# EAGLE design zigduino-v6 (EAGLE 5.10)
BOM: INCLUDE; COLOR: RED; DNP: T; PARTNO: C1608C0G1H090C; VOLT: 40V
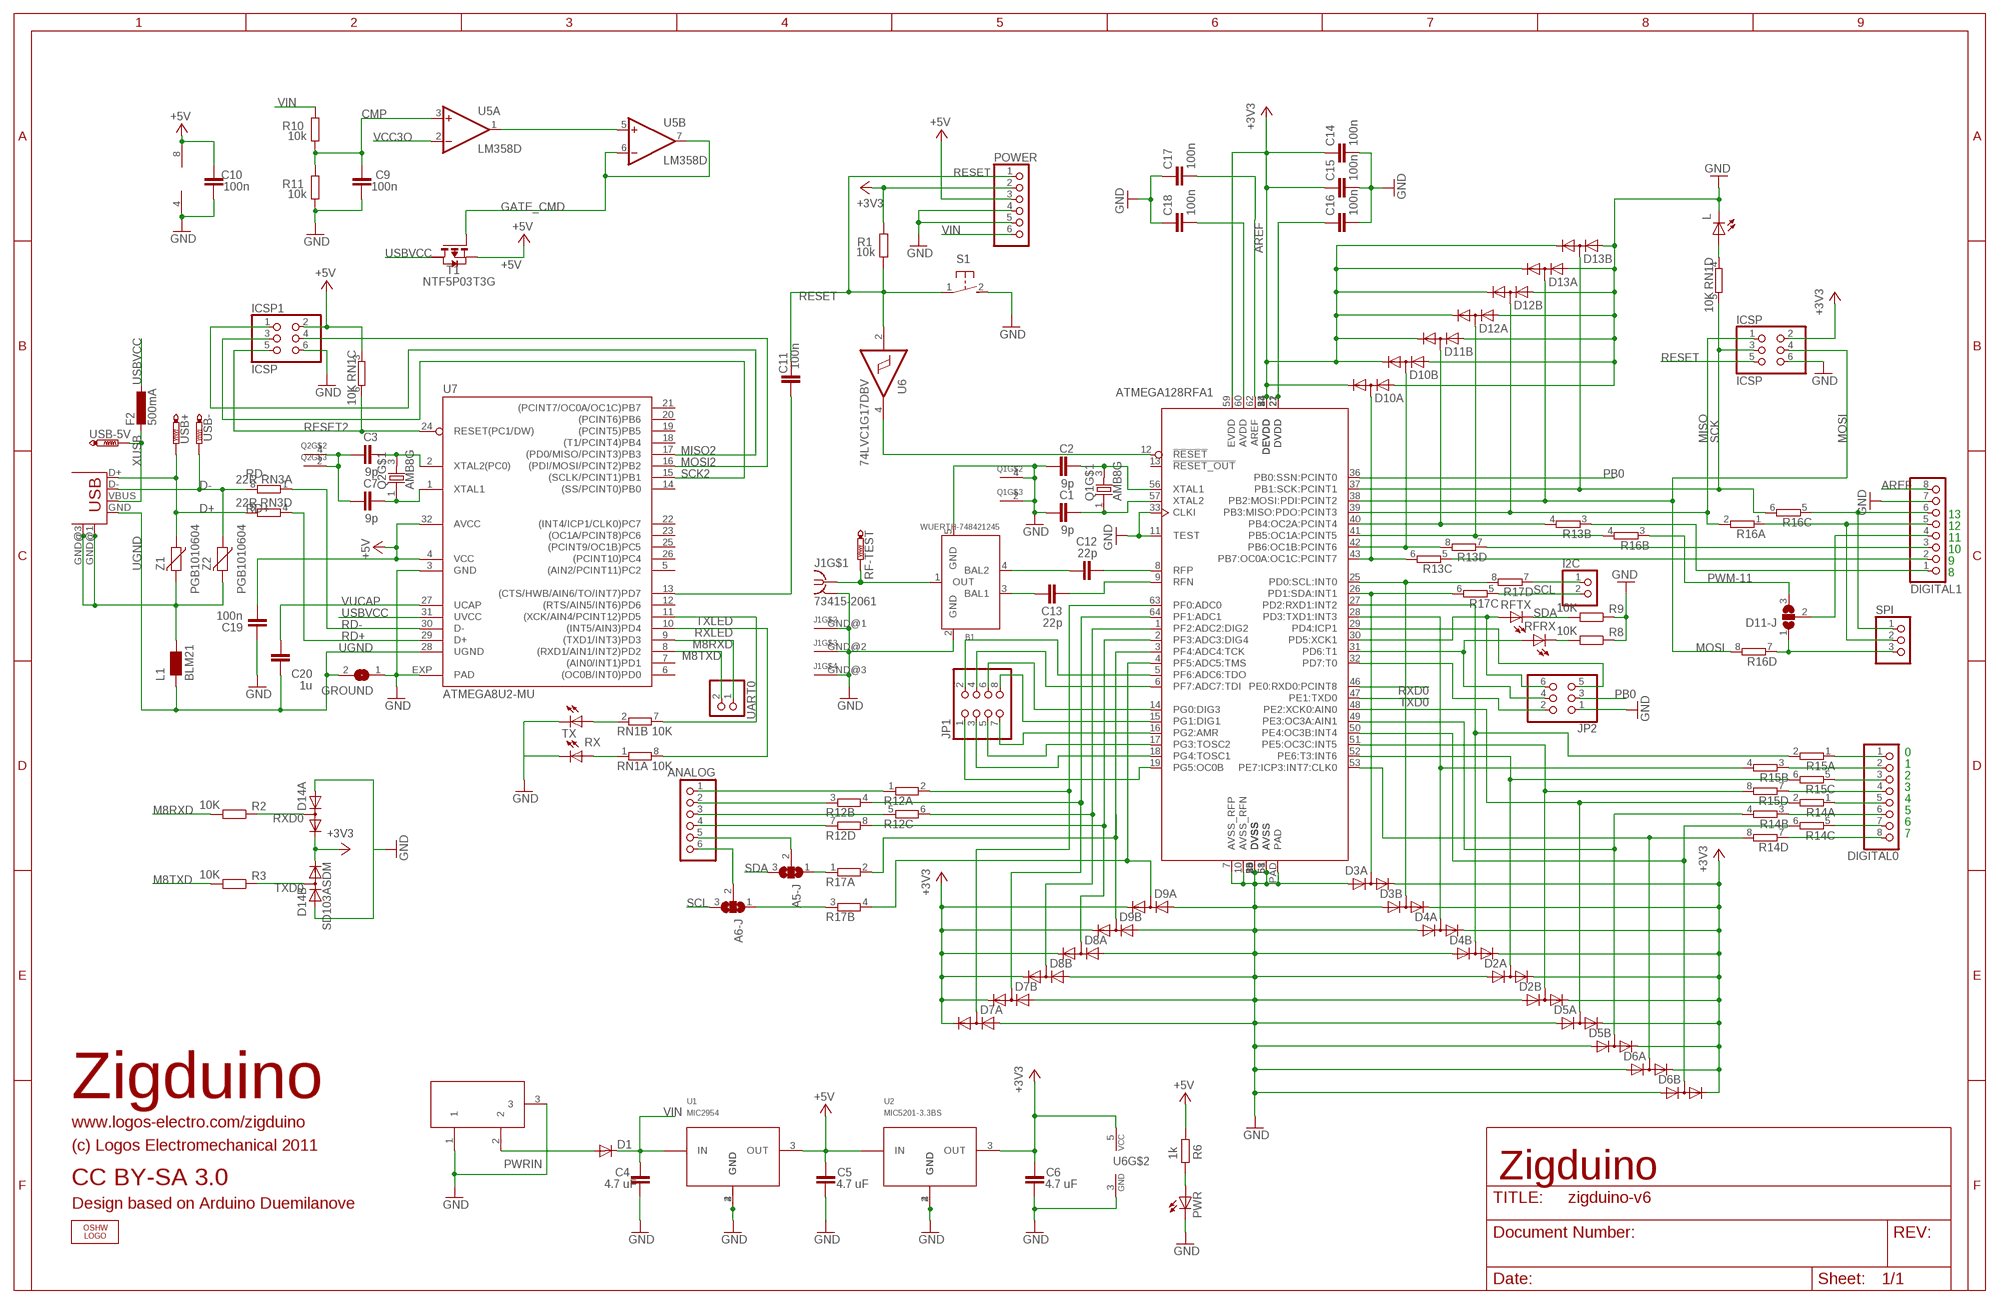
[diagram p0: schematic, sheet 1]

## Parts
A5-J  SJ2W  [SJ_2]
A6-J  SJ2W  [SJ_2]
ANALOG  PINHD-1X6  [1X06]
B1  WUERTH-748421245  [WURTH-BALUN]
C1  9p  C-EUC0603  [C0603]
C2  9p  C-EUC0603  [C0603]
C3  9p  C-EUC0603  [C0603]
C4  4.7 uF  C-EUC1206  [C1206]
C5  4.7 uF  C-EUC1206  [C1206]
C6  4.7 uF  C-EUC1206  [C1206]
C7  9p  C-EUC0603  [C0603]
C9  100n  C-EUC0603  [C0603]
C10  100n  C-EUC0603  [C0603]
C11  100n  C-EUC0603  [C0603]
C12  22p  C-EUC0603  [C0603]
C13  22p  C-EUC0603  [C0603]
C14  100n  C-EUC0603  [C0603]
C15  100n  C-EUC0603  [C0603]
C16  100n  C-EUC0603  [C0603]
C17  100n  C-EUC0603  [C0603]
C18  100n  C-EUC0603  [C0603]
C19  100n  C-EU0603-RND  [C0603-ROUND]
C20  1u  C-EU0603-RND  [C0603-ROUND]
D1  DIODE-SMB  [SMB]
D2  SD103ASDM  [SOT26]
D3  SD103ASDM  [SOT26]
D4  SD103ASDM  [SOT26]
D5  SD103ASDM  [SOT26]
D6  SD103ASDM  [SOT26]
D7  SD103ASDM  [SOT26]
D8  SD103ASDM  [SOT26]
D9  SD103ASDM  [SOT26]
D10  SD103ASDM  [SOT26]
D11  SD103ASDM  [SOT26]
D11-J  SJ2W  [SJ_2]
D12  SD103ASDM  [SOT26]
D13  SD103ASDM  [SOT26]
D14  SD103ASDM  [SOT26]
DC-PWR  DC21MMX  [DC-21MM]
DIGITAL0  PINHD-1X8  [1X08]
DIGITAL1  PINHD-1X8  [1X08]
F2  500mA  L-EUL1812  [L1812]
GROUND  SJ  [SJ]
I2C  PINHD-1X2  [1X02]
ICSP  ICSP  PINHD-2X3  [2X03]
ICSP1  ICSP  PINHD-2X3  [2X03]
J1  73415-2061  [MMCX]
JP1  PINHD-2X4_2.00  [2X04M]
JP2  PINHD-2X3_2.00  [2X03M]
L  LEDCHIP-LED0603  [CHIP-LED0603]
L1  BLM21  WE-CBF_0805  [0805]
LOGO1  OSHW_LOGO_FILLX0200-NT  [OSHW_FILLX200_NOTEXT]
POWER  PINHD-1X6  [1X06]
PWR  LEDCHIP-LED0603  [CHIP-LED0603]
Q1  AMB8G  [ABM8G]
Q2  AMB8G  [ABM8G]
R1  10k  R-EU_R0603  [R0603]
R2  10K  R-EU_R0603  [R0603]
R3  10K  R-EU_R0603  [R0603]
R6  1k  R-EU_R0603  [R0603]
R8  10K  R-EU_R0603  [R0603]
R9  10K  R-EU_R0603  [R0603]
R10  10k  R-EU_R0603  [R0603]
R11  10k  R-EU_R0603  [R0603]
R12  4R-NCTS742C083  [CTS742C083-RES]
R13  4R-NCTS742C083  [CTS742C083-RES]
R14  4R-NCTS742C083  [CTS742C083-RES]
R15  4R-NCTS742C083  [CTS742C083-RES]
R16  4R-NCTS742C083  [CTS742C083-RES]
R17  4R-NCTS742C083  [CTS742C083-RES]
RF-TEST  PTR1TP13SQ  [TP13SQ]
RFRX  LEDCHIP-LED0603  [CHIP-LED0603]
RFTX  LEDCHIP-LED0603  [CHIP-LED0603]
RN1  10K  4R-NCAY16  [CAY16]
RN3  22R  4R-NCAY16  [CAY16]
RX  LEDCHIP-LED0603  [CHIP-LED0603]
S1  B3U-1000  [B3U]
SPI  PINHD-1X3  [1X03]
T1  NTF5P03T3G  PMOSSOT223  [SOT223]
TX  LEDCHIP-LED0603  [CHIP-LED0603]
U1  MIC2954  [SOT223]
U2  MIC5201-3.3BS  [SOT223]
U3  ATMEGA128RFA1  [QFN64]
U5  LM358D  [SO08]
U6  74LVC1G17DBV  [SOT23-5]
U7  ATMEGA8U2-MU  [QFN32]
UART0  PINHD-1X2  [1X02]
USB  USB-MB-S  [USB-MB-S]
USB+  PTR1TP13SQ  [TP13SQ]
USB-  PTR1TP13SQ  [TP13SQ]
USB-5V  PTR1TP13SQ  [TP13SQ]
Z1  PGB1010604  VARISTORCN0603  [CT/CN0603]
Z2  PGB1010604  VARISTORCN0603  [CT/CN0603]

## Nets
+3V3: C6.1 C14.1 C15.1 D2.2(A:C) D2.5(B:C) D3.2(A:C) D3.5(B:C) D4.2(A:C) D4.5(B:C) D5.2(A:C) D5.5(B:C) D6.2(A:C) D6.5(B:C) D7.2(A:C) D7.5(B:C) D8.2(A:C) D8.5(B:C) D9.2(A:C) D9.5(B:C) D10.2(A:C) D10.5(B:C) D11.5(B:C) D12.2(A:C) D12.5(B:C) D13.2(A:C) D13.5(B:C) D14.2(A:C) D14.5(B:C) ICSP.2 POWER.2 R1.2 U2.3(OUT) U3.23(DEVDD) U3.34(DEVDD) U3.44(DEVDD) U3.54(DEVDD) U3.59(EVDD) U6.5(VCC)
+5V [usbvcc]: C5.1 C10.2 C19.1 ICSP1.2 POWER.3 R6.1 RN1.3 T1.3(S) U1.3(OUT) U2.1(IN) U5.8(P:V+) U7.4(VCC) U7.32(AVCC)
AREF [aref]: C17.2 DIGITAL1.8 U3.62(AREF)
CMP: C9.2 R10.1 R11.2 U5.3(A:+IN)
D+: RN3.5 USB+.TP USB.D+ Z1.1
D-: RN3.8 USB-.TP USB.D- Z2.1
DTR: C11.1 U7.13((CTS/HWB/AIN6/TO/INT7)PD7)
GATE_CMD: T1.1(G) U5.6(B:-IN) U5.7(B:OUT)
GND [gnd]: B1.2(GND) B1.5(GND) C1.1 C2.1 C4.2 C5.2 C6.2 C9.1 C10.1 C14.2 C15.2 C16.2 C17.1 C18.1 C19.2 D2.3(A:A) D2.6(B:A) D3.3(A:A) D3.6(B:A) D4.3(A:A) D4.6(B:A) D5.3(A:A) D5.6(B:A) D6.3(A:A) D6.6(B:A) D7.3(A:A) D7.6(B:A) D8.3(A:A) D8.6(B:A) D9.3(A:A) D9.6(B:A) D10.3(A:A) D10.6(B:A) D11.6(B:A) D12.3(A:A) D12.6(B:A) D13.3(A:A) D13.6(B:A) D14.3(A:A) D14.6(B:A) DC-PWR.1 DC-PWR.3 DIGITAL1.7 GROUND.1 ICSP1.6 ICSP.6 J1.GND@0(GND) J1.GND@1(PIN) J1.GND@2(PIN) J1.GND@3(PIN) JP2.1 L.C POWER.4 POWER.5 PWR.C Q1.2(PIN) Q1.4(PIN) R8.1 R9.1 R11.1 RX.C S1.2 TX.C U1.2(GND) U1.4(GND) U2.2(GND) U2.4(GND) U3.7(AVSS_RFP) U3.10(AVSS_RFN) U3.11(TEST) U3.20(DVSS) U3.24(DVSS) U3.33(CLKI) U3.35(DVSS) U3.45(DVSS) U3.55(DVSS) U3.58(AVSS) U3.61(AVSS) U3.PAD U5.4(P:V-) U6.3(GND) U7.3(GND) U7.EXP(PAD)
M8RXD: R2.2 U7.9((TXD1/INT3)PD3) UART0.1
M8TXD: R3.2 U7.8((RXD1/AIN1/INT2)PD2) UART0.2
MISO: D12.1(B:AC) ICSP.1 R16.2 U3.39(PB3:MISO:PDO:PCINT3)
MISO2: ICSP1.1 U7.17((PD0/MISO/PCINT3)PB3)
MOSI: D13.4(A:AC) ICSP.4 R16.8 U3.38(PB2:MOSI:PDI:PCINT2)
MOSI2: ICSP1.4 U7.16((PDI/MOSI/PCINT2)PB2)
MOSI-PIN: D11-J.1 R16.7 SPI.3
N$1: R9.2 RFTX.C
N$2: L.A RN1.4
N$3: PWR.A R6.2
N$4 [rf]: B1.4(BAL2) C12.1
N$5: DIGITAL0.3 R15.5
N$6: C1.2 Q1.1 U3.57(XTAL2)
N$7: C2.2 Q1.3 U3.56(XTAL1)
N$9 [rf]: B1.3(BAL1) C13.1
N$10: DIGITAL1.5 R16.1 SPI.2
N$11: DIGITAL0.5 R14.1
N$12: DIGITAL0.7 R14.5
N$13: DIGITAL0.6 R14.3
N$14: DIGITAL0.4 R15.7
N$15: DIGITAL0.8 R14.7
N$16: D3.1(B:AC) R17.8 U3.25(PD0:SCL:INT0)
N$17: D3.4(A:AC) R17.6 U3.26(PD1:SDA:INT1)
N$18 [gnd]: B1.1(OUT) J1.C RF-TEST.TP
N$19: D12.4(A:AC) R16.4 U3.41(PB5:OC1A:PCINT5)
N$20: R8.2 RFRX.C
N$21: D2.4(A:AC) R15.6 U3.52(PE6:T3:INT6)
N$22: D2.1(B:AC) R15.8 U3.51(PE5:OC3C:INT5)
N$23 [rf]: C12.2 U3.8(RFP)
N$24 [rf]: C13.2 U3.9(RFN)
N$25: DIGITAL1.6 R16.5 SPI.1
N$26: JP2.4 RFRX.A U3.31(PD6:T1)
N$27: JP2.6 RFTX.A U3.30(PD5:XCK1)
N$28: U5.1(A:OUT) U5.5(B:+IN)
N$29: U3.12(!RESET!) U6.4(O)
N$31: RN1.2 TX.A
N$32: RN1.1 RX.A
N$33: D11.1(B:AC) R13.4 U3.40(PB4:OC2A:PCINT4)
N$34: C3.2 Q2.3 U7.2(XTAL2(PC0))
N$35: C7.2 Q2.1 U7.1(XTAL1)
N$36: C3.1 C7.1 Q2.2(PIN) Q2.4(PIN)
N$38: D10.1(B:AC) R13.8 U3.42(PB6:OC1B:PCINT6)
N$39: D10.4(A:AC) R13.6 U3.43(PB7:OC0A:OC1C:PCINT7)
N$40: D5.4(A:AC) R14.2 U3.48(PE2:XCK0:AIN0)
N$41: D6.1(B:AC) R14.6 U3.50(PE4:OC3B:INT4)
N$42: D5.1(B:AC) R14.4 U3.49(PE3:OC3A:AIN1)
N$43: D6.4(A:AC) R14.8 U3.53(PE7:ICP3:INT7:CLK0)
N$44: A5-J.1 R17.1
N$45: A6-J.1 R17.3
N$46: JP1.2 U3.5(PF6:ADC6:TDO)
N$47: JP1.4 U3.6(PF7:ADC7:TDI)
N$48: D7.4(A:AC) R12.2 U3.63(PF0:ADC0)
N$49: D7.1(B:AC) R12.4 U3.64(PF1:ADC1)
N$50: D8.1(B:AC) R12.6 U3.1(PF2:ADC2:DIG2)
N$51: D8.4(A:AC) R12.8 U3.2(PF3:ADC3:DIG4)
N$52: D9.1(B:AC) R17.2 U3.3(PF4:ADC4:TCK)
N$53: D9.4(A:AC) R17.4 U3.4(PF5:ADC5:TMS)
N$54: ANALOG.1 R12.1
N$55: ANALOG.2 R12.3
N$56: ANALOG.3 R12.5
N$57: ANALOG.4 R12.7
N$58: A5-J.2 ANALOG.5
N$59: A6-J.2 ANALOG.6
N$60: DIGITAL1.1 R13.3
N$61: D11-J.2 DIGITAL1.4
N$62: JP1.6 U3.14(PG0:DIG3)
N$63: C16.1 U3.21(DVDD) U3.22(DVDD)
N$64: C18.2 U3.60(AVDD)
N$65: DIGITAL1.2 R13.5
N$68: DIGITAL0.1 R15.1
N$69: DIGITAL0.2 R15.3
N$70: JP1.8 U3.15(PG1:DIG1)
N$71: JP1.1 U3.19(PG5:OC0B)
N$72: JP1.3 U3.18(PG4:TOSC1)
N$73: JP1.5 U3.17(PG3:TOSC2)
N$74: JP1.7 U3.16(PG2:AMR)
N$75: JP2.2 U3.32(PD7:T0)
N$76: JP2.5 U3.29(PD4:ICP1)
PB0: JP2.3 U3.36(PB0:SSN:PCINT0)
PWM-10: DIGITAL1.3 R13.7
PWM-11: D11-J.3 R16.3
PWRIN [power]: D1.A DC-PWR.2
RD+: RN3.4 U7.29(D+)
RD-: RN3.1 U7.30(D-)
RESET: C11.2 ICSP.5 POWER.1 R1.1 S1.1 U6.2(I)
RESET2: ICSP1.5 RN1.6 U7.24(RESET(PC1/DW))
RXD0: D14.4(A:AC) R2.1 U3.46(PE0:RXD0:PCINT8)
RXD1: D4.1(B:AC) R15.2 U3.27(PD2:RXD1:INT2)
RXLED: RN1.8 U7.10((INT5/AIN3)PD4)
SCK: D13.1(B:AC) ICSP.3 R16.6 RN1.5 U3.37(PB1:SCK:PCINT1)
SCK2: ICSP1.3 U7.15((SCLK/PCINT1)PB1)
SCL: A6-J.3 I2C.1 R17.7
SDA: A5-J.3 I2C.2 R17.5
TXD0: D14.1(B:AC) R3.1 U3.47(PE1:TXD0)
TXD1: D4.4(A:AC) R15.4 U3.28(PD3:TXD1:INT3)
TXLED: RN1.7 U7.11((XCK/AIN4/PCINT12)PD5)
UGND: C20.2 GROUND.2 L1.1 U7.28(UGND) USB.GND
USBVCC [usbvcc]: F2.1 T1.2(D) U7.31(UVCC)
USHIELD: L1.2 USB.GND@1(GND) USB.GND@3(GND) Z1.2 Z2.2
VCC3O: U5.2(A:-IN)
VIN [power]: C4.1 D1.C POWER.6 R10.2 U1.1(IN)
VUCAP: C20.1 U7.27(UCAP)
XUSB: F2.2 USB-5V.TP USB.VBUS
Unconnected: D11.2(A:C) D11.3(A:A) D11.4(A:AC) R13.1 R13.2 RN3.2 RN3.3 RN3.6 RN3.7 T1.4(D2) U3.13(!RESET_OUT!) U7.5((AIN2/PCINT11)PC2) U7.6((OC0B/INT0)PD0) U7.7((AIN0/INT1)PD1) U7.12((RTS/AIN5/INT6)PD6) U7.14((SS/PCINT0)PB0) U7.18((T1/PCINT4)PB4) U7.19((PCINT5)PB5) U7.20((PCINT6)PB6) U7.21((PCINT7/OC0A/OC1C)PB7) U7.22((INT4/ICP1/CLK0)PC7) U7.23((OC1A/PCINT8)PC6) U7.25((PCINT9/OC1B)PC5) U7.26((PCINT10)PC4)

## Notes on the sheet
- ATMEGA128RFA1
- 13
- 12
- 11
- 10
- 9
- 8
- 0
- 1
- 2
- 3
- 4
- 5
- 6
- 7
- Zigduino
- www.logos-electro.com/zigduino
- (c) Logos Electromechanical 2011
- CC BY-SA 3.0 | Zigduino
- Design based on Arduino Duemilanove

## Library data of the parts
A5-J A6-J D11-J = jumper:SJ2W: SMD solder JUMPER
ANALOG POWER = pinhead:PINHD-1X6: PIN HEADER
B1 = atmega128rfa1:WUERTH-748421245: Recommended Balun for Atmega128RFA1
C1-C7 C9-C18 = resistor:C-EU: CAPACITOR, European symbol
C19 C20 = SmartPrj:C-EU: CAPACITOR, European symbol
D1 = diode:DIODE-: DIODE
D2-D14 = logos-diodes:SD103ASDM: Digikey SD103ASDM-FDICT-ND
DC-PWR = powersupply:DC21MM
DIGITAL0 DIGITAL1 = pinhead:PINHD-1X8: PIN HEADER
F2 = rcl:L-EU: INDUCTOR, European symbol
GROUND = jumper:SJ: SMD solder JUMPER
I2C UART0 = pinhead:PINHD-1X2: PIN HEADER
ICSP ICSP1 = pinhead:PINHD-2X3: PIN HEADER
J1 = atmega128rfa1:73415-2061: Molex 73415-2061
JP1 = pinhead-1:PINHD-2X4: PIN HEADER
JP2 = pinhead-1:PINHD-2X3: PIN HEADER
L PWR RFRX RFTX RX TX = led:LED: LED OSRAM: - CHIPLED LG R971, LG N971, LY N971, LG Q971, LY Q971, LO R971, LY R971 LH N974, LH R974 LS Q976, LO Q976, LY Q976 LO Q996 - Hyper CHIPLED LW Q18S LB Q993, LB Q99A, LB R99A - SideLED LS A670, LO A670, LY A670, LG A670, LP A670 LB A673, LV A673, LT A673, LW A673 LH A674 LY A675 LS A676, LA A676, LO A676, LY A676, LW A676 LS A679, LY A679, LG A679 - Hyper Micro SIDELED® LS Y876, LA Y876, LO Y876, LY Y876 LT Y87S - SmartLED LW L88C, LW L88S LB L89C, LB L89S, LG L890 LS L89K, LO L89K, LY L89K LS L896, LA L896, LO L896, LY L896 - TOPLED LS T670, LO T670, LY T670, LG T670, LP T670 LSG T670, LSP T670, LSY T670, LOP T670, LYG T670 LG T671, LOG T671, LSG T671 LB T673, LV T673, LT T673, LW T673 LH T674 LS T676, LA T676, LO T676, LY T676, LB T676, LH T676, LSB T676, LW T676 LB T67C, LV T67C, LT T67C, LS T67K, LO T67K, LY T67K, LW E67C LS E67B, LA E67B, LO E67B, LY E67B, LB E67C, LV E67C, LT E67C LW T67C LS T679, LY T679, LG T679 LS T770, LO T770, LY T770, LG T770, LP T770 LB T773, LV T773, LT T773, LW T773 LH T774 LS E675, LA E675, LY E675, LS T675 LS T776, LA T776, LO T776, LY T776, LB T776 LHGB T686 LT T68C, LB T68C - Hyper Mini TOPLED® LB M676 - Mini TOPLED Santana® LG M470 LS M47K, LO M47K, LY M47K Source: http://www.osram.convergy.de LUXEON: - LUMILED® LXK2-PW12-R00, LXK2-PW12-S00, LXK2-PW14-U00, LXK2-PW14-V00 LXK2-PM12-R00, LXK2-PM12-S00, LXK2-PM14-U00 LXK2-PE12-Q00, LXK2-PE12-R00, LXK2-PE12-S00, LXK2-PE14-T00, LXK2-PE14-U00 LXK2-PB12-K00, LXK2-PB12-L00, LXK2-PB12-M00, LXK2-PB14-N00, LXK2-PB14-P00, LXK2-PB14-Q00 LXK2-PR12-L00, LXK2-PR12-M00, LXK2-PR14-Q00, LXK2-PR14-R00 LXK2-PD12-Q00, LXK2-PD12-R00, LXK2-PD12-S00 LXK2-PH12-R00, LXK2-PH12-S00 LXK2-PL12-P00, LXK2-PL12-Q00, LXK2-PL12-R00 Source: www.luxeon.com KINGBRIGHT: KA-3528ASYC Source: www.kingbright.com
L1 = wuerth-elektronik:WE-CBF: SMD EMI Suppression Ferrite Beads - excellent anti-EMI properties - low DCR - impedances till 3000 ohms - rated current up to 6 A
LOGO1 = OSHW:OSHW_LOGO_FILL
Q1 Q2 = atmega128rfa1:AMB8G: AMB8G series ultraminature crystal
R1-R3 R6 R8-R11 = resistor:R-EU_: RESISTOR, European symbol
R12-R17 = res-cap-arrays:4R-N: Array Chip Resistor Source: RS Component / Phycomp
RF-TEST USB+ USB- USB-5V = testpad:PTR1: TEST PIN
RN1 RN3 = resistor-dil:4R-N: Array Chip Resistor Source: RS Component / Phycomp
S1 = logos-faves:B3U-1000: Omron B3U-1000 SMD tact switch
SPI = pinhead:PINHD-1X3: PIN HEADER
T1 = zetex:PMOSSOT223: MOS FET
U1 = logos-faves:MIC2954: 5V 250mA regulator
U2 = logos-faves:MIC5201: 200 mA 3.3V LDO linear regulator
U3 = atmega128rfa1:ATMEGA128RFA1: Atmega128RFA1 -- Atmega128 with Zigbee
U5 = linear:LM358: OP AMP also LM158; LM258; LM2904 Source: http://cache.national.com/ds/LM/LM158.pdf
U6 = 74xx-little-us:74*1G17: Single Schmitt-Trigger Buffer
U7 = atmel:ATMEGA8U2-MU
USB = con-usb-2:USB: USB Connectors
Z1 Z2 = varistor:VARISTOR: VARISTOR

## Net classes
0 default: width 0.152 mm, drill 0.305 mm, clearance 0.152 mm
1 power: width 0.305 mm, drill 0.381 mm
2 gnd: width 0.305 mm, drill 0.381 mm
3 usbvcc: width 0.305 mm, drill 0.381 mm
4 aref: width 0.305 mm
5 rf: width 0.305 mm

## Board
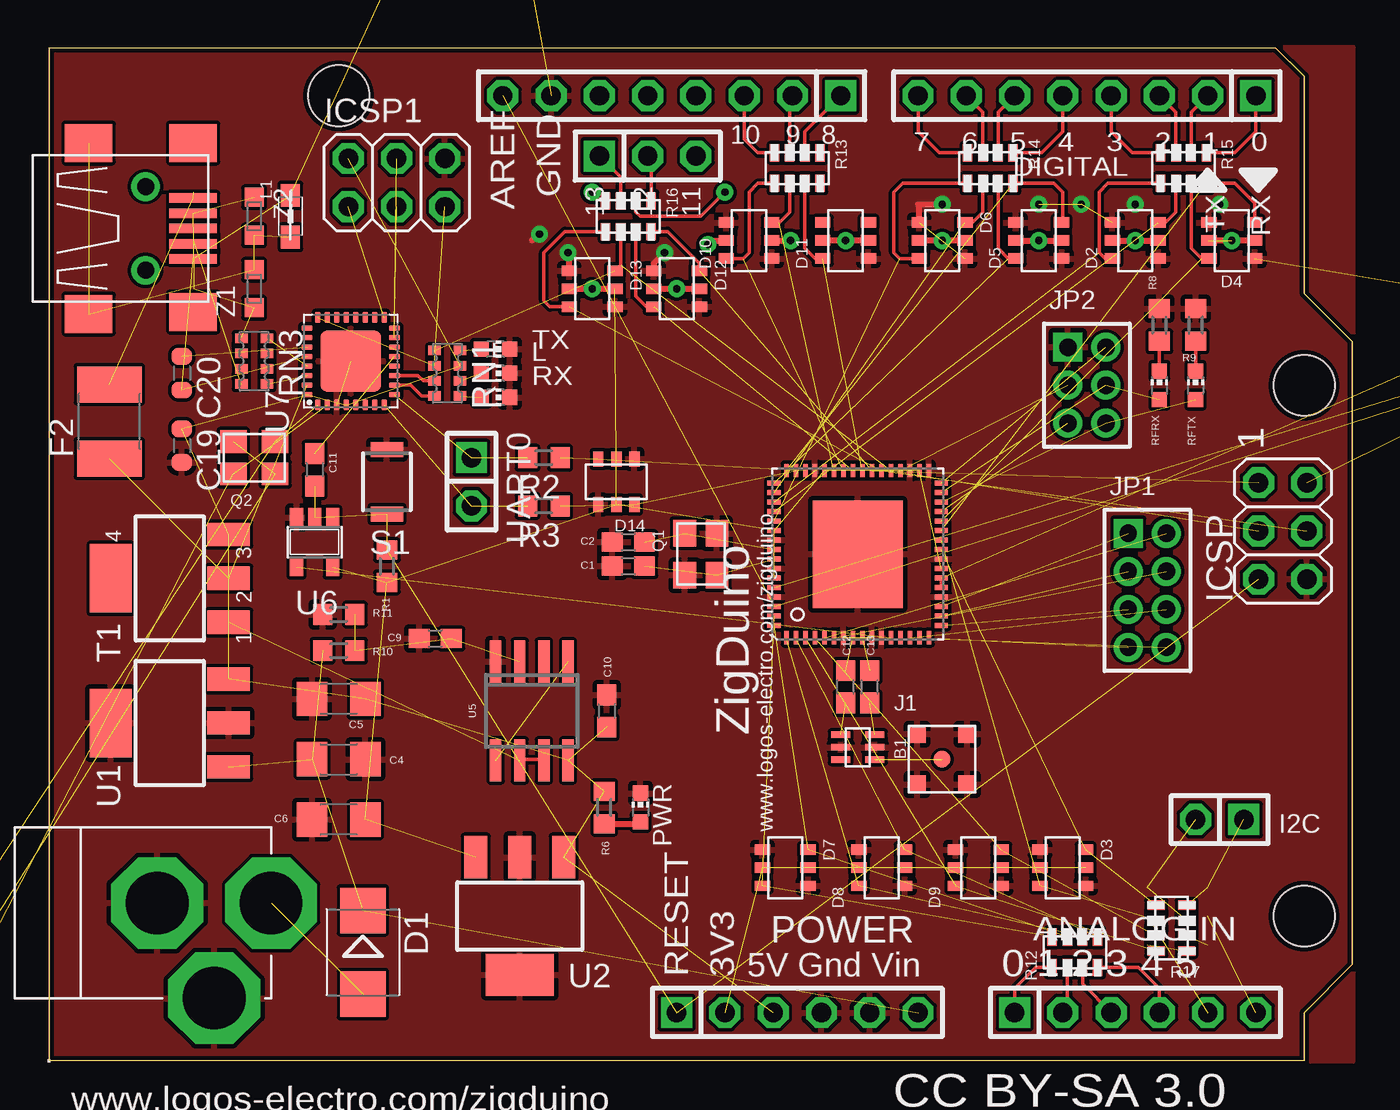
[diagram p1: board, top side]
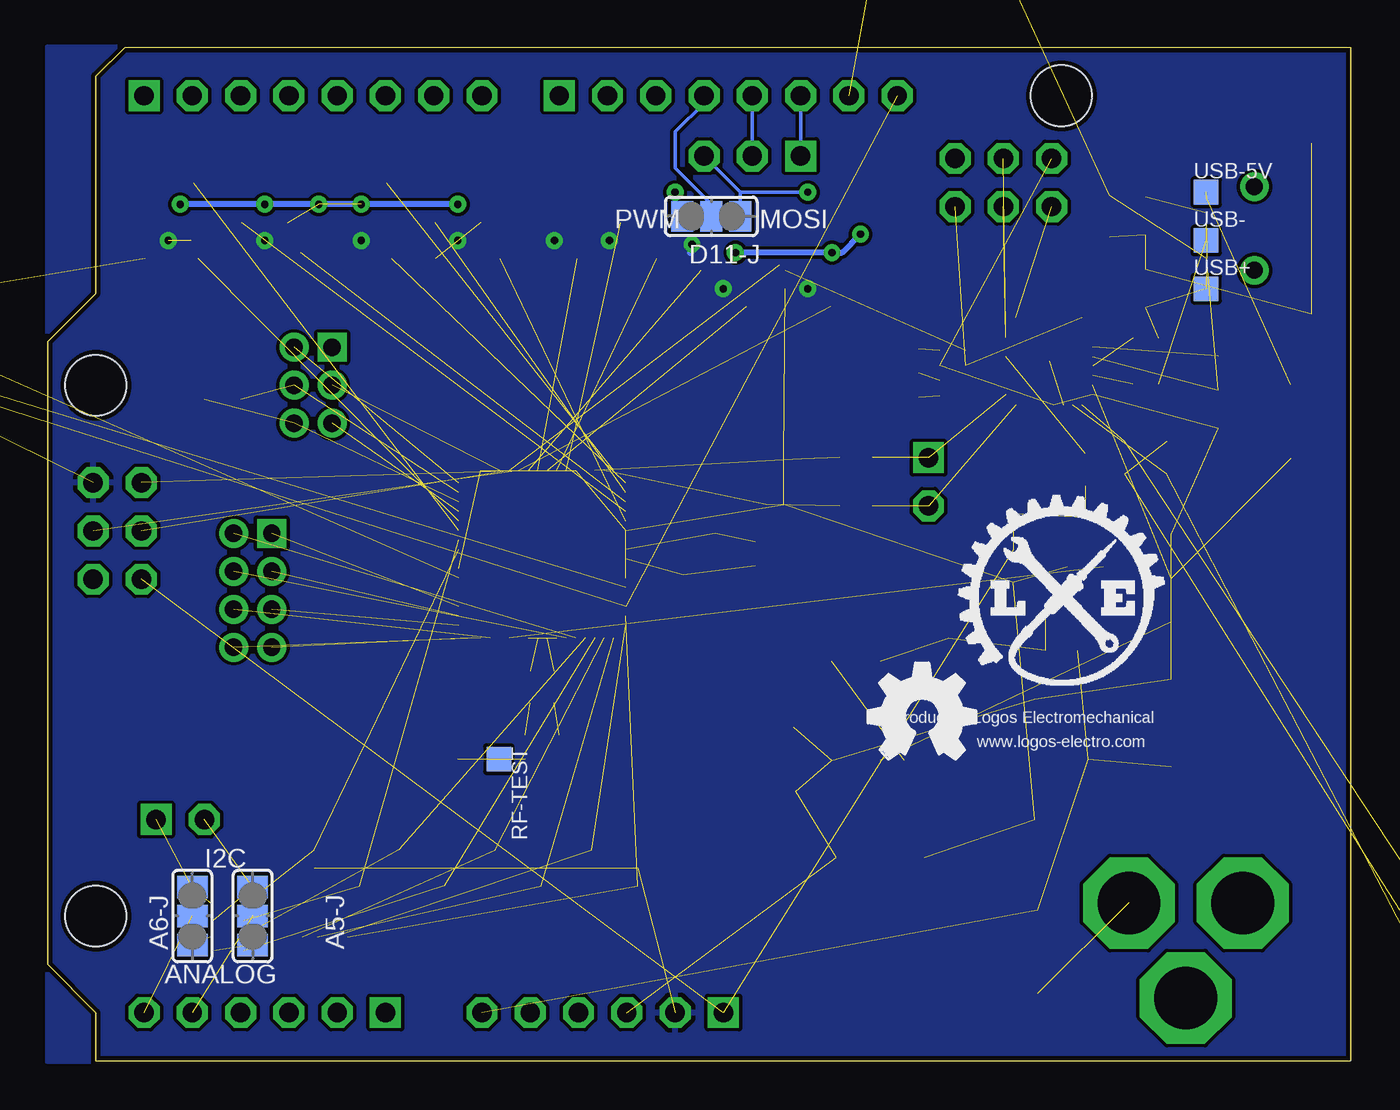
[diagram p2: board, bottom side, seen from below]

Size 68.58 x 53.34 mm. Coordinates in mm from the lower left corner, seen from the top.
Outline: 0,53.34 64.52,53.34 66.04,51.82 66.04,40.39 68.58,37.85 68.58,5.08 66.04,2.54 66.04,0 0,0 0,53.34
Copper layers (1*16): Top 0.0356mm / dielectric 1.5011mm / Bottom 0.0356mm
Design rules "hbl-panel-7mil *": minimum track width 7mil, minimum drill 15mil, track to track 7mil, track to pad 7mil, pad to pad 7mil, via to via 7mil, smd to smd 0mil, copper to edge 10mil, drill to drill 8mil, minimum pad ring 12mil, minimum via ring 10mil, stop-mask expansion 0mil, vias tented up to drill 50mil, thermal gap 10mil
Holes 3.2 mm at 66.04,35.56 66.04,7.62 15.24,50.8
Milling: 7 lines

### Footprints (pad centres in the part's own frame; a part is rotated, then mirrored left to right if it is on the bottom)
SJ_2 = smd 1.168 x 1.6: 1 -1.524,0; 2 0,0; 3 1.524,0
1X06 = drill 1.016 square: 1 -6.35,0 | drill 1.016 octagon: 2 -3.81,0; 3 -1.27,0; 4 1.27,0; 5 3.81,0; 6 6.35,0
WURTH-BALUN = smd 0.35 x 1: 1 0.65,0.9; 2 0,0.9; 3 -0.65,0.9; 4 -0.65,-0.9; 5 0,-0.9; 6 0.65,-0.9
C0603 = smd 1.1 x 1: 1 -0.85,0; 2 0.85,0
C1206 = smd 1.6 x 1.8: 1 -1.4,0; 2 1.4,0
C0603-ROUND = smd 0.898 x 1.1: 1 -0.889,0; 2 0.889,0
SMB = smd 2.4 x 2.4: A 2.2,0; C -2.2,0
SOT26 = smd 0.55 x 0.8: 1 -0.95,1.2; 2 0,1.2; 3 0.95,1.2; 4 0.95,-1.2; 5 0,-1.2; 6 -0.95,-1.2
DC-21MM = drill 3.302 pad 4.826 octagon: 1 -5.08,-3.353; 2 -0.076,-6.35; 3 -0.076,-0.356
1X08 = drill 1.016 square: 1 -8.89,0 | drill 1.016 octagon: 2 -6.35,0; 3 -3.81,0; 4 -1.27,0; 5 1.27,0; 6 3.81,0; 7 6.35,0; 8 8.89,0
L1812 = smd 1.9 x 3.4: 1 -1.95,0; 2 1.95,0
SJ = smd 1.168 x 1.6: 1 -0.762,0; 2 0.762,0
1X02 = drill 1.016 square: 1 -1.27,0 | drill 1.016 octagon: 2 1.27,0
2X03 = drill 1.016 octagon: 1 -2.54,-1.27; 2 -2.54,1.27; 3 0,-1.27; 4 0,1.27; 5 2.54,-1.27; 6 2.54,1.27
MMCX = smd 0.89 x 0.89: C 0,0 | smd 0.94 x 0.94: GND@0 -1.32,1.32; GND@1 1.32,1.32; GND@2 -1.32,-1.32; GND@3 1.32,-1.32
2X04M = drill 0.914 square: 1 -3,-1 | drill 0.914 round: 2 -3,1; 3 -1,-1; 4 -1,1; 5 1,-1; 6 1,1; 7 3,-1; 8 3,1
2X03M = drill 0.914 square: 1 -2,-1 | drill 0.914 round: 2 -2,1; 3 0,-1; 4 0,1; 5 2,-1; 6 2,1
CHIP-LED0603 = smd 0.8 x 0.8: A 0,-0.75; C 0,0.75
0805 = smd 1.2 x 1: 1 -1.1,0; 2 1.1,0
ABM8G = smd 1.4 x 1.2: 1 -1.1,-0.85; 2 1.1,-0.85; 3 1.1,0.85; 4 -1.1,0.85
R0603 = smd 1 x 1.1: 1 -0.85,0; 2 0.85,0
CTS742C083-RES = smd 0.9 x 0.5: 1 -0.8,1.2; 2 0.8,1.2; 3 -0.8,0.4; 4 0.8,0.4; 5 -0.8,-0.4; 6 0.8,-0.4; 7 -0.8,-1.2; 8 0.8,-1.2
TP13SQ = smd 1.3 x 1.3: TP 0,0
CAY16 = smd 0.5 x 0.65: 1 -1.2,-0.675; 2 -0.4,-0.675; 3 0.4,-0.675; 4 1.2,-0.675; 5 1.2,0.675; 6 0.4,0.675; 7 -0.4,0.675; 8 -1.2,0.675
B3U = smd 0.8 x 1.7: 1 -1.7,0; 2 1.7,0
1X03 = drill 1.016 square: 1 -2.54,0 | drill 1.016 octagon: 2 0,0; 3 2.54,0
SOT223 = smd 1.219 x 2.235: 1 -2.311,-3.099; 2 0,-3.099; 3 2.311,-3.099 | smd 3.6 x 2.2: 4 0,3.099
QFN64 = smd 0.7 x 0.25: 1 -4.4,3.75; 2 -4.4,3.25; 3 -4.4,2.75; 4 -4.4,2.25; 5 -4.4,1.75; 6 -4.4,1.25; 7 -4.4,0.75; 8 -4.4,0.25; 9 -4.4,-0.25; 10 -4.4,-0.75; 11 -4.4,-1.25; 12 -4.4,-1.75; 13 -4.4,-2.25; 14 -4.4,-2.75; 15 -4.4,-3.25; 16 -4.4,-3.75; 33 4.4,-3.75; 34 4.4,-3.25; 35 4.4,-2.75; 36 4.4,-2.25; 37 4.4,-1.75; 38 4.4,-1.25; 39 4.4,-0.75; 40 4.4,-0.25; 41 4.4,0.25; 42 4.4,0.75; 43 4.4,1.25; 44 4.4,1.75; 45 4.4,2.25; 46 4.4,2.75; 47 4.4,3.25; 48 4.4,3.75 | smd 0.25 x 0.7: 17 -3.75,-4.4; 18 -3.25,-4.4; 19 -2.75,-4.4; 20 -2.25,-4.4; 21 -1.75,-4.4; 22 -1.25,-4.4; 23 -0.75,-4.4; 24 -0.25,-4.4; 25 0.25,-4.4; 26 0.75,-4.4; 27 1.25,-4.4; 28 1.75,-4.4; 29 2.25,-4.4; 30 2.75,-4.4; 31 3.25,-4.4; 32 3.75,-4.4; 49 3.75,4.4; 50 3.25,4.4; 51 2.75,4.4; 52 2.25,4.4; 53 1.75,4.4; 54 1.25,4.4; 55 0.75,4.4; 56 0.25,4.4; 57 -0.25,4.4; 58 -0.75,4.4; 59 -1.25,4.4; 60 -1.75,4.4; 61 -2.25,4.4; 62 -2.75,4.4; 63 -3.25,4.4; 64 -3.75,4.4 | smd 5.65 x 4.75: PAD 0,0
SO08 = smd 0.6 x 2.2: 1 -1.905,-2.6; 2 -0.635,-2.6; 3 0.635,-2.6; 4 1.905,-2.6; 5 1.905,2.6; 6 0.635,2.6; 7 -0.635,2.6; 8 -1.905,2.6
SOT23-5 = smd 0.69 x 0.99: 1 -0.95,-1.29; 2 0,-1.29; 3 0.95,-1.29; 4 0.95,1.3; 5 -0.95,1.3
QFN32 = smd 0.6 x 0.3: 1 -2.3,1.75; 2 -2.3,1.25; 3 -2.3,0.75; 4 -2.3,0.25; 5 -2.3,-0.25; 6 -2.3,-0.75; 7 -2.3,-1.25; 8 -2.3,-1.75; 17 2.3,-1.75; 18 2.3,-1.25; 19 2.3,-0.75; 20 2.3,-0.25; 21 2.3,0.25; 22 2.3,0.75; 23 2.3,1.25; 24 2.3,1.75 | smd 0.3 x 0.6: 9 -1.75,-2.3; 10 -1.25,-2.3; 11 -0.75,-2.3; 12 -0.25,-2.3; 13 0.25,-2.3; 14 0.75,-2.3; 15 1.25,-2.3; 16 1.75,-2.3; 25 1.75,2.3; 26 1.25,2.3; 27 0.75,2.3; 28 0.25,2.3; 29 -0.25,2.3; 30 -0.75,2.3; 31 -1.25,2.3; 32 -1.75,2.3 | smd 3.2 x 3.2: EXP 0,0
USB-MB-S = smd 2.5 x 0.5: D+ 2.5,0; D- 2.5,0.8; GND 2.5,-1.6; ID 2.5,-0.8; VBUS 2.5,1.6 | smd 2.5 x 2: GND@1 -3,4.5; GND@2 2.5,4.5; GND@3 -3,-4.5; GND@4 2.5,-4.4 | drill 0.9 round: P$5 0,2.2; P$6 0,-2.2
CT/CN0603 = smd 1 x 1: 1 -1,0; 2 1,0

### Placement (x,y rotation side)
A5-J  57.78,7.62 90 bottom
A6-J  60.96,7.62 90 bottom
ANALOG  57.15,2.54 0 top
B1  42.55,16.51 270 top
C1  30.48,26.04 0 top
C2  30.48,27.3 0 top
C3  -9.53,-4.45 0 top  (outside the outline)
C4  15.24,15.88 0 top
C5  15.24,19.05 180 top
C6  15.24,12.7 180 top
C7  -13.34,-4.45 0 top  (outside the outline)
C9  20.32,22.23 0 top
C10  29.34,18.41 270 top
C11  13.97,31.11 270 top
C12  41.91,19.68 90 top
C13  43.18,19.68 90 top
C14  84.45,38.61 270 top  (outside the outline)
C15  82.55,48.26 180 top  (outside the outline)
C16  81.92,40.01 270 top  (outside the outline)
C17  87,38.61 90 top  (outside the outline)
C18  85.72,38.61 90 top  (outside the outline)
C19  6.99,32.38 270 top
C20  6.99,36.2 270 top
D1  16.51,5.71 270 top
D2  57.15,43.18 90 top
D3  53.34,10.16 270 top
D4  62.23,43.18 270 top
D5  52.07,43.18 90 top
D6  46.99,43.18 270 top
D7  38.73,10.16 270 top
D8  43.81,10.16 90 top
D9  48.9,10.16 90 top
D10  36.83,43.18 90 top
D11  41.91,43.18 90 top
D11-J  33.66,44.45 180 bottom
D12  33.02,40.64 270 top
D13  28.57,40.64 270 top
D14  29.84,30.48 180 top
DC-PWR  5.33,8.38 90 top
DIGITAL0  54.61,50.8 180 top
DIGITAL1  32.77,50.8 180 top
F2  3.17,33.66 90 top
GROUND  22.86,66.04 180 top  (outside the outline)
I2C  61.59,12.7 180 top
ICSP  64.91,27.89 270 top
ICSP1  18.29,46.23 0 top
J1  46.99,15.88 0 top
JP1  57.78,24.77 270 top
JP2  54.61,35.56 270 top
L  23.5,37.47 270 top
L1  12.7,44.45 270 top
LOGO1  25.4,15.88 0 bottom
POWER  39.37,2.54 0 top
PWR  31.11,13.34 0 top
Q1  34.29,26.67 90 top
Q2  10.79,31.75 180 top
R1  17.78,26.04 270 top
R2  26.04,31.75 180 top
R3  26.04,29.21 180 top
R6  29.21,13.34 270 top
R8  58.42,38.73 270 top
R9  60.33,38.73 270 top
R10  15.24,21.59 180 top
R11  15.24,23.5 0 top
R12  53.98,5.71 90 top
R13  39.37,46.99 270 top
R14  49.53,46.99 270 top
R15  59.69,46.99 270 top
R16  30.48,44.45 270 top
R17  59.05,6.99 180 top
RF-TEST  44.83,15.88 270 bottom
RFRX  58.42,35.56 0 top
RFTX  60.33,35.56 0 top
RN1  20.95,36.2 90 top
RN3  10.79,36.83 90 top
RX  23.5,34.92 270 top
S1  17.78,30.48 90 top
SPI  31.5,47.62 0 top
T1  6.35,25.4 90 top
TX  23.5,36.2 270 top
U1  6.35,17.78 90 top
U2  24.77,7.62 180 top
U3  42.55,26.67 90 top
U5  25.4,18.41 180 top
U6  13.97,27.3 180 top
U7  15.88,36.83 90 top
U$4  [LOGO-SM]  21.08,19.43 0 bottom
UART0  22.23,30.48 270 top
USB  5.08,43.81 0 top
USB+  7.62,40.64 0 bottom
USB-  7.62,43.18 0 bottom
USB-5V  7.62,45.72 0 bottom
Z1  10.79,40.64 90 top
Z2  10.79,44.45 270 top

### Tracks (layer width: path | path; a pad name or v marks a point on that pad's centre or on a via)
+3V3  (via drill 0.38)  (22 unrouted)
  Top 0.305: D13.5 v28.57,40.64 D13.2 | D12.5 v33.02,40.64 D12.2 | 40.64,43.18 v41.91,43.18 D11.5 | D6.2 v46.99,43.18 D6.5 | D5.2 v52.07,43.18 D5.5 | D2.2 v57.15,43.18 D2.5 | D4.2 D4.5 | D10.2 34.87,43.18 v34.67,42.98 | D10.5 v39.01,43.18
  Bottom 0.305: v34.67,42.98 34.67,42.62 34.77,42.52
  other vias: 62.23,43.18
  pour Bottom (rank 3): 0,53.34 68.58,53.34 68.58,0 0,0
+5V  (12 unrouted)
AREF  (2 unrouted)
CMP  (3 unrouted)
D+  (3 unrouted)
D-  (3 unrouted)
DTR  (1 unrouted)
GATE_CMD  (1 unrouted)
  Top 0.178: U5.6 25.02,15.88 25.78,15.88 U5.7
GND  (via drill 0.38)  (11 unrouted)
  Top 0.305: D13.6 27.38,42.48 v27.3,42.55 | v25.81,43.51 25.73,43.51 25.4,43.18 | D12.6 31.82,41.98 v32.38,42.55 | D6.6 45.79,45.02 45.72,45.09 v46.99,45.09
  Bottom 0.305: v25.81,43.51 26.77,42.55 v27.3,42.55 v32.38,42.55 | v46.99,45.09 v61.59,45.09
  other vias: 57.15,45.09 52.07,45.09 54.31,45.09
  pour Top (rank 2): 0,53.34 68.58,53.34 68.58,0 0,0
M8RXD  (2 unrouted)
M8TXD  (2 unrouted)
MISO  (2 unrouted)
  Top 0.178: R16.2 32.55,43.65 34.22,41.98 D12.1
MISO2  (1 unrouted)
MOSI  (2 unrouted)
  Top 0.178: R16.8 27.14,43.65 26.04,42.55 26.04,40.01 26.35,39.69 D13.4
MOSI2  (1 unrouted)
MOSI-PIN  (via drill 0.38)
  Top 0.178: R16.7 29.05,45.25 v28.57,45.72
  Bottom 0.178: 32.13,45.72 D11-J.1 | 32.13,45.72 SPI.3 | v28.57,45.72 32.13,45.72
N$1
  Top 0.178: RFTX.C R9.2
N$2  (1 unrouted)
N$3
  Top 0.305: R6.2 31.02,12.48 PWR.A
N$4  (1 unrouted)
N$5
  Top 0.178: R15.5 59.29,49.93 DIGITAL0.3
N$6  (2 unrouted)
N$7  (2 unrouted)
N$9  (1 unrouted)
N$10
  Top 0.178: R16.1 31.68,47.44 SPI.2
  Bottom 0.178: SPI.2 DIGITAL1.5
N$11
  Top 0.178: R14.1 52.23,47.79 53.34,48.9 DIGITAL0.5
N$12
  Top 0.178: R14.5 49.13,49.93 DIGITAL0.7
N$13
  Top 0.178: R14.3 49.93,49.93 DIGITAL0.6
N$14
  Top 0.178: R15.7 56.98,47.79 55.88,48.9 DIGITAL0.4
N$15
  Top 0.178: R14.7 46.83,47.79 45.72,48.9 DIGITAL0.8
N$16  (2 unrouted)
N$17  (2 unrouted)
N$18  (2 unrouted)
N$19  (1 unrouted)
  Top 0.178: R16.4 30.88,40.24 31.43,39.69 D12.4
N$20
  Top 0.178: RFRX.C R8.2
N$21  (1 unrouted)
  Top 0.178: D2.4 58.73,44.13 59.29,44.69 R15.6
N$22  (1 unrouted)
  Top 0.178: R15.8 55.72,46.19 55.24,45.72 55.24,42.55 55.56,42.23 D2.1
N$23  (1 unrouted)
N$24  (1 unrouted)
N$25
  Top 0.178: R16.5 30.08,46.5 SPI.1
  Bottom 0.178: SPI.1 DIGITAL1.6
N$26  (2 unrouted)
N$27  (2 unrouted)
N$28  (1 unrouted)
N$29  (1 unrouted)
N$30
  Top 0.005: 0.02,-0.05 arc10 0.03,-0.04 | 0.04,-0.03 arc19 0.05,-0.01 | 0.05,0.01 arc19 0.04,0.03 | 0.03,0.04 arc19 0.01,0.05 | -0.03,0.04 arc-19 -0.01,0.05 | -0.05,0.01 arc-19 -0.04,0.03 | -0.04,-0.03 arc-19 -0.05,-0.01 | -0.02,-0.05 arc-10 -0.03,-0.04 | -0.02,0 arc68 -0.01,-0.02 | 0.01,-0.02 arc248 -0.02,0 | 0.02,-0.05 arc10 0.03,-0.04 | 0.03,-0.04 0.05,-0.06 0.06,-0.05 0.04,-0.03 | 0.04,-0.03 arc19 0.05,-0.01 | 0.05,-0.01 0.08,-0.01 0.08,0.01 0.05,0.01 | 0.05,0.01 arc19 0.04,0.03 | 0.04,0.03 0.06,0.05 0.05,0.06 0.03,0.04 | 0.03,0.04 arc19 0.01,0.05 | 0.01,0.05 0.01,0.08 -0.01,0.08 -0.01,0.05 | -0.03,0.04 arc-19 -0.01,0.05 | -0.03,0.04 -0.05,0.06 -0.06,0.05 -0.04,0.03 | -0.05,0.01 arc-19 -0.04,0.03 | -0.05,0.01 -0.08,0.01 -0.08,-0.01 -0.05,-0.01 | -0.04,-0.03 arc-19 -0.05,-0.01 | -0.04,-0.03 -0.06,-0.05 -0.05,-0.06 -0.03,-0.04 | -0.02,-0.05 arc-10 -0.03,-0.04 | -0.01,-0.02 -0.02,-0.05 | -0.02,0 arc68 -0.01,-0.02 | 0.01,-0.02 arc248 -0.02,0 | 0.02,-0.05 0.01,-0.02
N$31  (1 unrouted)
N$32  (1 unrouted)
N$33  (1 unrouted)
  Top 0.178: R13.4 39.77,42.78 40.32,42.23 D11.1
N$34  (2 unrouted)
N$35  (2 unrouted)
N$36  (3 unrouted)
N$38  (1 unrouted)
  Top 0.178: D10.1 36.52,42.23 36.83,42.55 36.83,45.72 37.3,46.19 R13.8
N$39  (1 unrouted)
  Top 0.178: R13.6 38.97,44.69 38.41,44.13 D10.4
N$40  (1 unrouted)
  Top 0.178: R14.2 52.87,46.19 53.34,45.72 53.34,44.2 D5.4
N$41  (1 unrouted)
  Top 0.178: D6.1 48.58,44.13 49.13,44.69 R14.6
N$42  (1 unrouted)
  Top 0.178: D5.1 50.48,42.23 49.93,42.78 R14.4
N$43  (1 unrouted)
  Top 0.178: R14.8 44.92,46.19 44.45,45.72 44.45,42.55 44.77,42.23 D6.4
N$44  (1 unrouted)
N$45  (1 unrouted)
N$46  (1 unrouted)
N$47  (1 unrouted)
N$48  (2 unrouted)
N$49  (2 unrouted)
N$50  (2 unrouted)
N$51  (2 unrouted)
N$52  (2 unrouted)
N$53  (2 unrouted)
N$54
  Top 0.178: R12.1 51.91,4.92 50.8,3.81 ANALOG.1
N$55
  Top 0.178: R12.3 53.58,2.77 ANALOG.2
N$56
  Top 0.178: R12.5 54.38,4.04 ANALOG.3
N$57
  Top 0.178: R12.7 57.31,4.92 58.42,3.81 ANALOG.4
N$58  (1 unrouted)
N$59  (1 unrouted)
N$60
  Top 0.178: R13.3 39.77,48.91 DIGITAL1.1
N$61
  Bottom 0.178: DIGITAL1.4 34.04,50.42 35.56,48.9 35.56,46.99 33.66,45.09 D11-J.2
N$62  (1 unrouted)
N$63  (1 unrouted)
  Top 0.178: U3.21 U3.22
N$64  (1 unrouted)
N$65
  Top 0.178: R13.5 38.97,50.65 DIGITAL1.2
N$68
  Top 0.178: R15.1 62.4,47.79 63.5,48.9 DIGITAL0.1
N$69
  Top 0.178: R15.3 60.09,49.93 DIGITAL0.2
N$70  (1 unrouted)
N$71  (1 unrouted)
N$72  (1 unrouted)
N$73  (1 unrouted)
N$74  (1 unrouted)
N$75  (1 unrouted)
N$76  (1 unrouted)
PB0  (1 unrouted)
PWM-10
  Top 0.178: R13.7 37.3,47.79 37.15,47.94 36.83,48.26 36.58,48.51 DIGITAL1.3
PWM-11  (via drill 0.38)
  Top 0.178: R16.3 30.88,44.69 31.11,44.45 34.29,44.45 v35.56,45.72
  Bottom 0.178: v35.56,45.72 35.56,44.83 D11-J.3
PWRIN  (1 unrouted)
RD+  (1 unrouted)
RD-  (1 unrouted)
RESET  (5 unrouted)
RESET2  (2 unrouted)
RXD0  (2 unrouted)
RXD1  (1 unrouted)
  Top 0.178: R15.2 62.4,46.19 63.43,45.16 D4.1
RXLED
  Top 0.178: U7.10 19.03,35.58 19.61,34.99 RN1.8
SCK  (3 unrouted)
  Top 0.178: R16.6 30.08,41.9 D13.1
SCK2  (1 unrouted)
SCL  (2 unrouted)
SDA  (2 unrouted)
TXD0  (2 unrouted)
TXD1  (1 unrouted)
  Top 0.178: R15.4 60.09,42.78 60.64,42.23 D4.4
TXLED
  Top 0.178: RN1.7 19.68,35.8 19.4,36.08 U7.11
UGND  (4 unrouted)
USBVCC  (2 unrouted)
USHIELD  (4 unrouted)
VIN  (4 unrouted)
VUCAP  (1 unrouted)
XUSB  (2 unrouted)

### Text on the board
tPlace: SCL | SDA
tNames: 10 | 9 | 8 | 7 | 6 | 5 | 4 | 3 | 2 | 1 | 0 | DIGITAL | TX | RX | AREF | GND | 13 | 12 | 11 | TX | RX | 1 | ZigDuino | www.logos-electro.com/zigduino | ANALOG IN | RESET | 3V3 | 5V Gnd Vin | 0 1 2 3 4 5 | CC BY-SA 3.0 | www.logos-electro.com/zigduino
bNames: MOSI | PWM | Product of Logos Electromechanical | www.logos-electro.com | I2C | ANALOG
Reference: C8 | R7 | R5 | R6 | R4 | C3 | C2 | R9 | R8 | R1 | R2 | C1 | C4 | C5 | X2 | C7 | C6